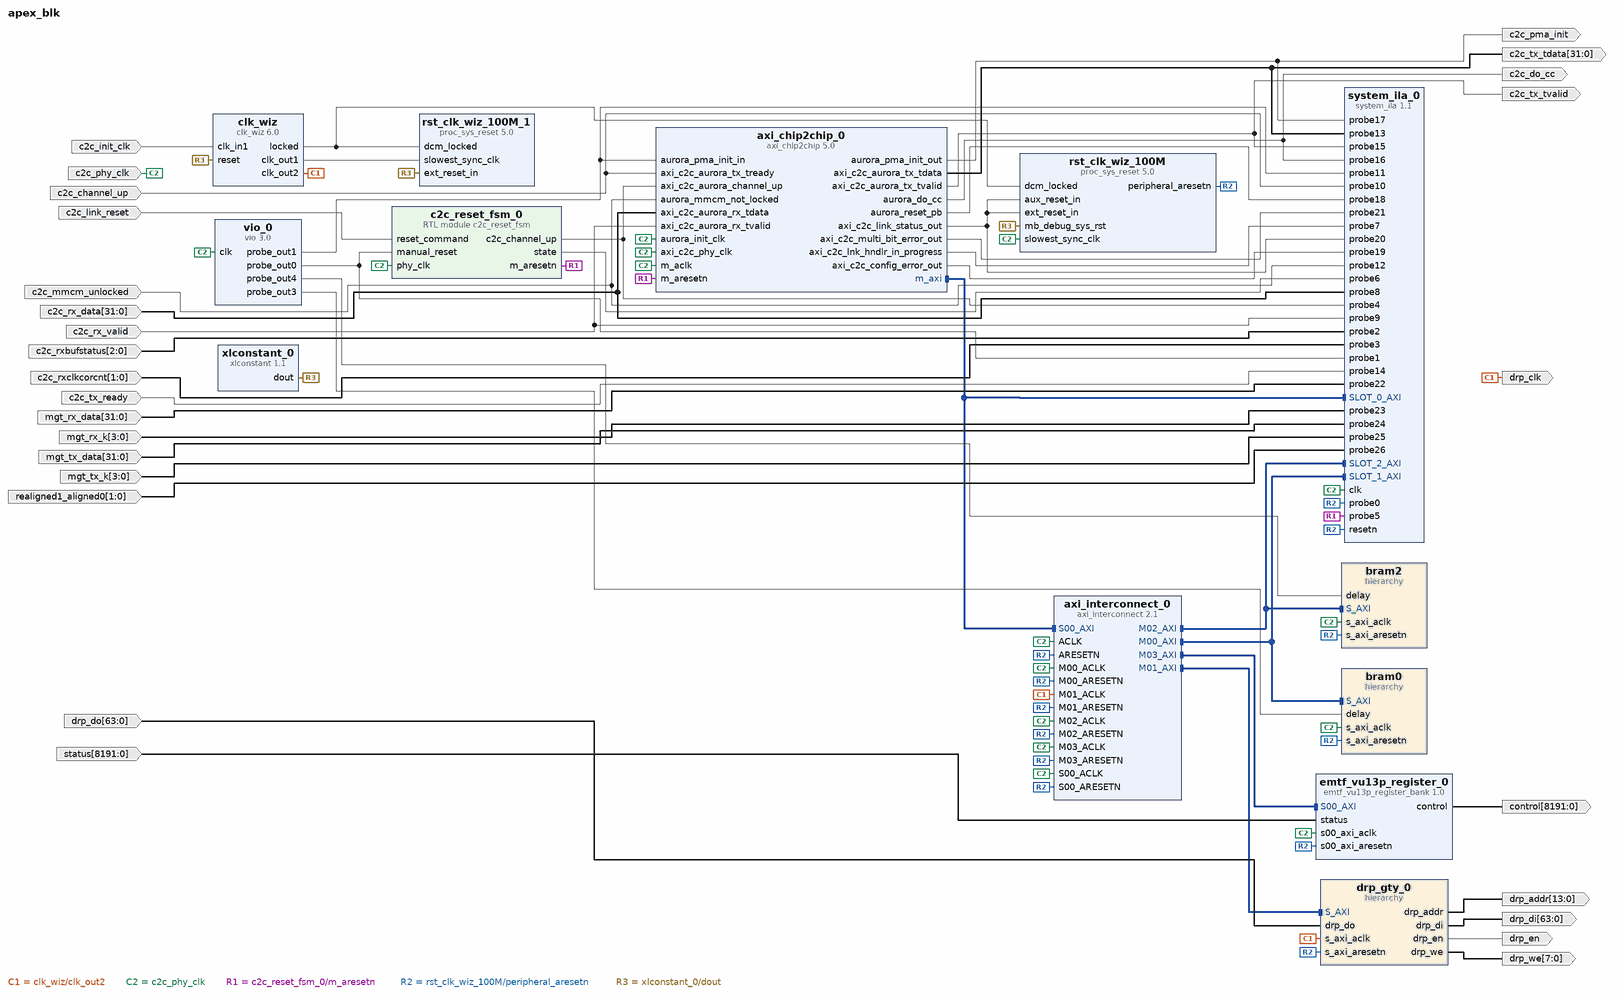
[diagram p0: block diagram of the top level]
# Vivado block design apex_blk, xcvu13p-fsga2577-1-e, Vivado 2022.2
create_bd_design apex_blk

create_bd_port -dir I c2c_channel_up
create_bd_port -dir O c2c_do_cc
create_bd_port -dir I -type clk c2c_init_clk
set_property -dict {CONFIG.FREQ_HZ 156250000} [get_bd_ports c2c_init_clk]
create_bd_port -dir I c2c_link_reset
create_bd_port -dir I -type rst c2c_mmcm_unlocked
set_property -dict {CONFIG.POLARITY ACTIVE_HIGH} [get_bd_ports c2c_mmcm_unlocked]
create_bd_port -dir I -type clk c2c_phy_clk
set_property -dict {CONFIG.FREQ_HZ 195312500 CONFIG.PHASE 0} [get_bd_ports c2c_phy_clk]
create_bd_port -dir O -type rst c2c_pma_init
create_bd_port -dir I -from 31 -to 0 c2c_rx_data
create_bd_port -dir I c2c_rx_valid
create_bd_port -dir I -from 2 -to 0 c2c_rxbufstatus
create_bd_port -dir I -from 1 -to 0 c2c_rxclkcorcnt
create_bd_port -dir I c2c_tx_ready
create_bd_port -dir O -from 31 -to 0 c2c_tx_tdata
create_bd_port -dir O c2c_tx_tvalid
create_bd_port -dir O -from 13 -to 0 drp_addr
create_bd_port -dir O -type clk drp_clk
create_bd_port -dir O -from 63 -to 0 drp_di
create_bd_port -dir I -from 63 -to 0 drp_do
create_bd_port -dir O drp_en
create_bd_port -dir O -from 7 -to 0 drp_we
create_bd_port -dir I -from 31 -to 0 -type data mgt_rx_data
create_bd_port -dir I -from 3 -to 0 -type data mgt_rx_k
create_bd_port -dir I -from 31 -to 0 -type data mgt_tx_data
create_bd_port -dir I -from 3 -to 0 -type data mgt_tx_k
create_bd_port -dir I -from 1 -to 0 -type data realigned1_aligned0
create_bd_port -dir I -from 8191 -to 0 status
create_bd_port -dir O -from 8191 -to 0 control

create_bd_cell -type hier bram0
create_bd_cell -type hier bram2
create_bd_cell -type module -reference c2c_reset_fsm c2c_reset_fsm_0
create_bd_cell -type hier drp_gty_0
create_bd_cell -type ip -vlnv xilinx.com:ip:proc_sys_reset:5.0 rst_clk_wiz_100M
create_bd_cell -type ip -vlnv xilinx.com:ip:proc_sys_reset:5.0 rst_clk_wiz_100M_1
create_bd_cell -type ip -vlnv xilinx.com:ip:axi_interconnect:2.1 axi_interconnect_0
set_property -dict {CONFIG.NUM_MI 4} [get_bd_cells axi_interconnect_0]
create_bd_cell -type ip -vlnv xilinx.com:ip:clk_wiz:6.0 clk_wiz
set_property -dict [list \
  CONFIG.CLKIN1_JITTER_PS 64.0 \
  CONFIG.CLKOUT1_JITTER 107.681 \
  CONFIG.CLKOUT1_PHASE_ERROR 83.183 \
  CONFIG.CLKOUT2_JITTER 123.168 \
  CONFIG.CLKOUT2_PHASE_ERROR 83.183 \
  CONFIG.CLKOUT2_REQUESTED_OUT_FREQ 50 \
  CONFIG.CLKOUT2_USED true \
  CONFIG.MMCM_CLKFBOUT_MULT_F 8.000 \
  CONFIG.MMCM_CLKIN1_PERIOD 6.400 \
  CONFIG.MMCM_CLKIN2_PERIOD 10.0 \
  CONFIG.MMCM_CLKOUT0_DIVIDE_F 12.500 \
  CONFIG.MMCM_CLKOUT1_DIVIDE 25 \
  CONFIG.MMCM_DIVCLK_DIVIDE 1 \
  CONFIG.NUM_OUT_CLKS 2 \
] [get_bd_cells clk_wiz]
create_bd_cell -type ip -vlnv xilinx.com:ip:system_ila:1.1 system_ila_0
set_property -dict [list \
  CONFIG.C_INPUT_PIPE_STAGES 6 \
  CONFIG.C_MON_TYPE MIX \
  CONFIG.C_NUM_MONITOR_SLOTS 3 \
  CONFIG.C_NUM_OF_PROBES 27 \
] [get_bd_cells system_ila_0]
create_bd_cell -type ip -vlnv xilinx.com:ip:vio:3.0 vio_0
set_property -dict [list \
  CONFIG.C_NUM_PROBE_IN 0 \
  CONFIG.C_NUM_PROBE_OUT 5 \
  CONFIG.C_PROBE_OUT0_WIDTH 1 \
  CONFIG.C_PROBE_OUT2_INIT_VAL 0x1 \
  CONFIG.C_PROBE_OUT3_INIT_VAL 0x11 \
  CONFIG.C_PROBE_OUT3_WIDTH 7 \
  CONFIG.C_PROBE_OUT4_INIT_VAL 0x61 \
  CONFIG.C_PROBE_OUT4_WIDTH 7 \
] [get_bd_cells vio_0]
create_bd_cell -type ip -vlnv xilinx.com:ip:xlconstant:1.1 xlconstant_0
set_property -dict {CONFIG.CONST_VAL 0} [get_bd_cells xlconstant_0]
create_bd_cell -type ip -vlnv user.org:user:emtf_vu13p_register_bank:1.0 emtf_vu13p_register_0
create_bd_cell -type ip -vlnv xilinx.com:ip:axi_chip2chip:5.0 axi_chip2chip_0
set_property -dict [list \
  CONFIG.C_ECC_ENABLE false \
  CONFIG.C_EN_AXI_LINK_HNDLR true \
  CONFIG.C_INTERFACE_MODE 1 \
  CONFIG.C_INTERFACE_TYPE 3 \
  CONFIG.C_MASTER_FPGA 0 \
  CONFIG.C_M_AXI_WUSER_WIDTH 0 \
] [get_bd_cells axi_chip2chip_0]

# ---- hierarchy /bram0 ----
current_bd_instance /bram0
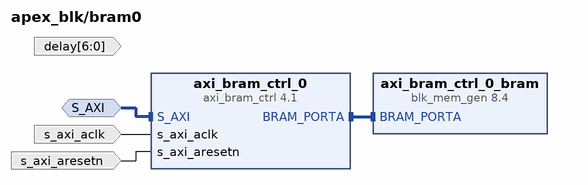
[diagram p1: block diagram inside /bram0]
create_bd_intf_pin -mode Slave -vlnv xilinx.com:interface:aximm_rtl:1.0 S_AXI
create_bd_pin -dir I -from 6 -to 0 delay
create_bd_pin -dir I -type clk s_axi_aclk
create_bd_pin -dir I -type rst s_axi_aresetn

create_bd_cell -type ip -vlnv xilinx.com:ip:blk_mem_gen:8.4 axi_bram_ctrl_0_bram
set_property -dict [list \
  CONFIG.Memory_Type Single_Port_RAM \
  CONFIG.Port_B_Clock 0 \
  CONFIG.Port_B_Enable_Rate 0 \
  CONFIG.Port_B_Write_Rate 0 \
] [get_bd_cells axi_bram_ctrl_0_bram]
create_bd_cell -type ip -vlnv xilinx.com:ip:axi_bram_ctrl:4.1 axi_bram_ctrl_0
set_property -dict {CONFIG.SINGLE_PORT_BRAM 1} [get_bd_cells axi_bram_ctrl_0]

# ---- hierarchy /bram2 ----
current_bd_instance /bram2
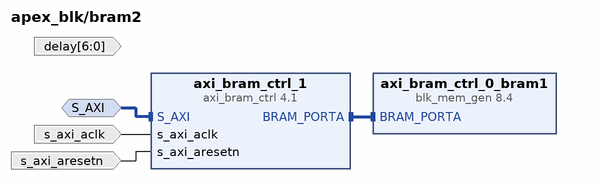
[diagram p2: block diagram inside /bram2]
create_bd_intf_pin -mode Slave -vlnv xilinx.com:interface:aximm_rtl:1.0 S_AXI
create_bd_pin -dir I -from 6 -to 0 delay
create_bd_pin -dir I -type clk s_axi_aclk
create_bd_pin -dir I -type rst s_axi_aresetn

create_bd_cell -type ip -vlnv xilinx.com:ip:blk_mem_gen:8.4 axi_bram_ctrl_0_bram1
create_bd_cell -type ip -vlnv xilinx.com:ip:axi_bram_ctrl:4.1 axi_bram_ctrl_1
set_property -dict {CONFIG.READ_LATENCY 1 CONFIG.SINGLE_PORT_BRAM 1} [get_bd_cells axi_bram_ctrl_1]

# ---- hierarchy /drp_gty_0 ----
current_bd_instance /drp_gty_0
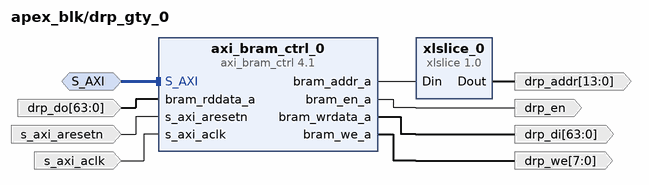
[diagram p3: block diagram inside /drp_gty_0]
create_bd_intf_pin -mode Slave -vlnv xilinx.com:interface:aximm_rtl:1.0 S_AXI
create_bd_pin -dir O -from 13 -to 0 drp_addr
create_bd_pin -dir O -from 63 -to 0 drp_di
create_bd_pin -dir I -from 63 -to 0 drp_do
create_bd_pin -dir O drp_en
create_bd_pin -dir O -from 7 -to 0 drp_we
create_bd_pin -dir I -type clk s_axi_aclk
create_bd_pin -dir I -type rst s_axi_aresetn

create_bd_cell -type ip -vlnv xilinx.com:ip:xlslice:1.0 xlslice_0
set_property -dict {CONFIG.DIN_FROM 16 CONFIG.DIN_TO 3 CONFIG.DIN_WIDTH 17 CONFIG.DOUT_WIDTH 14} [get_bd_cells xlslice_0]
create_bd_cell -type ip -vlnv xilinx.com:ip:axi_bram_ctrl:4.1 axi_bram_ctrl_0
set_property -dict {CONFIG.DATA_WIDTH 64 CONFIG.SINGLE_PORT_BRAM 1} [get_bd_cells axi_bram_ctrl_0]

# ---- connections ----

current_bd_instance /bram0
connect_bd_intf_net [get_bd_intf_pins S_AXI] [get_bd_intf_pins axi_bram_ctrl_0/S_AXI]
connect_bd_intf_net [get_bd_intf_pins axi_bram_ctrl_0/BRAM_PORTA] [get_bd_intf_pins axi_bram_ctrl_0_bram/BRAM_PORTA]
connect_bd_net [get_bd_pins s_axi_aclk] [get_bd_pins axi_bram_ctrl_0/s_axi_aclk]
connect_bd_net [get_bd_pins s_axi_aresetn] [get_bd_pins axi_bram_ctrl_0/s_axi_aresetn]

current_bd_instance /bram2
connect_bd_intf_net [get_bd_intf_pins axi_bram_ctrl_0_bram1/BRAM_PORTA] [get_bd_intf_pins axi_bram_ctrl_1/BRAM_PORTA]
connect_bd_intf_net [get_bd_intf_pins S_AXI] [get_bd_intf_pins axi_bram_ctrl_1/S_AXI]
connect_bd_net -net clk_wiz_clk_out1 [get_bd_pins s_axi_aclk] [get_bd_pins axi_bram_ctrl_1/s_axi_aclk]
connect_bd_net -net rst_clk_wiz_100M_peripheral_aresetn [get_bd_pins s_axi_aresetn] [get_bd_pins axi_bram_ctrl_1/s_axi_aresetn]

current_bd_instance /drp_gty_0
connect_bd_intf_net [get_bd_intf_pins S_AXI] [get_bd_intf_pins axi_bram_ctrl_0/S_AXI]
connect_bd_net [get_bd_pins axi_bram_ctrl_0/bram_addr_a] [get_bd_pins xlslice_0/Din]
connect_bd_net [get_bd_pins axi_bram_ctrl_0/bram_en_a] [get_bd_pins drp_en]
connect_bd_net [get_bd_pins axi_bram_ctrl_0/bram_we_a] [get_bd_pins drp_we]
connect_bd_net [get_bd_pins axi_bram_ctrl_0/bram_wrdata_a] [get_bd_pins drp_di]
connect_bd_net [get_bd_pins drp_do] [get_bd_pins axi_bram_ctrl_0/bram_rddata_a]
connect_bd_net -net rst_clk_wiz_100M_peripheral_aresetn [get_bd_pins s_axi_aresetn] [get_bd_pins axi_bram_ctrl_0/s_axi_aresetn]
connect_bd_net [get_bd_pins s_axi_aclk] [get_bd_pins axi_bram_ctrl_0/s_axi_aclk]
connect_bd_net [get_bd_pins xlslice_0/Dout] [get_bd_pins drp_addr]

current_bd_instance /
connect_bd_intf_net [get_bd_intf_pins axi_chip2chip_0/m_axi] [get_bd_intf_pins axi_interconnect_0/S00_AXI]
connect_bd_intf_net [get_bd_intf_pins axi_chip2chip_0/m_axi] [get_bd_intf_pins system_ila_0/SLOT_0_AXI]
connect_bd_intf_net [get_bd_intf_pins axi_interconnect_0/M00_AXI] [get_bd_intf_pins bram0/S_AXI]
connect_bd_intf_net [get_bd_intf_pins axi_interconnect_0/M00_AXI] [get_bd_intf_pins system_ila_0/SLOT_1_AXI]
connect_bd_intf_net [get_bd_intf_pins axi_interconnect_0/M01_AXI] [get_bd_intf_pins drp_gty_0/S_AXI]
connect_bd_intf_net [get_bd_intf_pins axi_interconnect_0/M02_AXI] [get_bd_intf_pins bram2/S_AXI]
connect_bd_intf_net [get_bd_intf_pins axi_interconnect_0/M02_AXI] [get_bd_intf_pins system_ila_0/SLOT_2_AXI]
connect_bd_intf_net [get_bd_intf_pins axi_interconnect_0/M03_AXI] [get_bd_intf_pins emtf_vu13p_register_0/S00_AXI]
connect_bd_net [get_bd_pins clk_wiz/clk_out2] [get_bd_ports drp_clk] [get_bd_pins drp_gty_0/s_axi_aclk] [get_bd_pins axi_interconnect_0/M01_ACLK]
connect_bd_net -net aurora_pma_init [get_bd_pins vio_0/probe_out1] [get_bd_pins system_ila_0/probe11] [get_bd_pins axi_chip2chip_0/aurora_pma_init_in]
connect_bd_net -net aurora_pma_init_out [get_bd_pins axi_chip2chip_0/aurora_pma_init_out] \
  [get_bd_ports c2c_pma_init] [get_bd_pins system_ila_0/probe17]
connect_bd_net -net aurora_reset_pb [get_bd_pins axi_chip2chip_0/aurora_reset_pb] [get_bd_pins system_ila_0/probe18]
connect_bd_net -net axi_bram_ctrl_0_bram_en_a [get_bd_pins drp_gty_0/drp_en] [get_bd_ports drp_en]
connect_bd_net -net axi_bram_ctrl_0_bram_we_a [get_bd_pins drp_gty_0/drp_we] [get_bd_ports drp_we]
connect_bd_net -net axi_bram_ctrl_0_bram_wrdata_a [get_bd_pins drp_gty_0/drp_di] [get_bd_ports drp_di]
connect_bd_net -net axi_c2c_multi_bit_error_out [get_bd_pins axi_chip2chip_0/axi_c2c_multi_bit_error_out] [get_bd_pins system_ila_0/probe21]
connect_bd_net -net axi_c2c_phy_clk_0_1 [get_bd_ports c2c_phy_clk] \
  [get_bd_pins bram0/s_axi_aclk] [get_bd_pins bram2/s_axi_aclk] [get_bd_pins c2c_reset_fsm_0/phy_clk] \
  [get_bd_pins rst_clk_wiz_100M/slowest_sync_clk] [get_bd_pins axi_interconnect_0/ACLK] \
  [get_bd_pins axi_interconnect_0/S00_ACLK] [get_bd_pins axi_interconnect_0/M00_ACLK] \
  [get_bd_pins axi_interconnect_0/M02_ACLK] [get_bd_pins axi_interconnect_0/M03_ACLK] [get_bd_pins system_ila_0/clk] \
  [get_bd_pins vio_0/clk] [get_bd_pins emtf_vu13p_register_0/s00_axi_aclk] [get_bd_pins axi_chip2chip_0/m_aclk] \
  [get_bd_pins axi_chip2chip_0/axi_c2c_phy_clk] [get_bd_pins axi_chip2chip_0/aurora_init_clk]
connect_bd_net [get_bd_pins axi_chip2chip_0/axi_c2c_lnk_hndlr_in_progress] [get_bd_pins system_ila_0/probe7]
connect_bd_net -net bram1_delay [get_bd_pins vio_0/probe_out3] [get_bd_pins bram0/delay]
connect_bd_net -net bram2_delay [get_bd_pins vio_0/probe_out4] [get_bd_pins bram2/delay]
connect_bd_net [get_bd_ports c2c_channel_up] [get_bd_pins system_ila_0/probe10] [get_bd_pins axi_chip2chip_0/axi_c2c_aurora_tx_tready]
connect_bd_net -net c2c_config_error_out [get_bd_pins axi_chip2chip_0/axi_c2c_config_error_out] [get_bd_pins system_ila_0/probe19]
connect_bd_net [get_bd_ports c2c_link_reset] [get_bd_pins c2c_reset_fsm_0/reset_command]
connect_bd_net -net c2c_link_status_out [get_bd_pins axi_chip2chip_0/axi_c2c_link_status_out] \
  [get_bd_pins rst_clk_wiz_100M/aux_reset_in] [get_bd_pins rst_clk_wiz_100M/ext_reset_in] [get_bd_pins system_ila_0/probe20]
connect_bd_net -net c2c_m_aresetn [get_bd_pins c2c_reset_fsm_0/m_aresetn] [get_bd_pins system_ila_0/probe5] [get_bd_pins axi_chip2chip_0/m_aresetn]
connect_bd_net [get_bd_ports c2c_mmcm_unlocked] [get_bd_pins system_ila_0/probe12] [get_bd_pins axi_chip2chip_0/aurora_mmcm_not_locked]
connect_bd_net -net c2c_reset_fsm_state [get_bd_pins c2c_reset_fsm_0/state] [get_bd_pins system_ila_0/probe6]
connect_bd_net [get_bd_ports c2c_rx_data] [get_bd_pins system_ila_0/probe8] [get_bd_pins axi_chip2chip_0/axi_c2c_aurora_rx_tdata]
connect_bd_net [get_bd_ports c2c_rx_valid] [get_bd_pins system_ila_0/probe9] [get_bd_pins axi_chip2chip_0/axi_c2c_aurora_rx_tvalid]
connect_bd_net [get_bd_ports c2c_rxbufstatus] [get_bd_pins system_ila_0/probe2]
connect_bd_net [get_bd_ports c2c_rxclkcorcnt] [get_bd_pins system_ila_0/probe3]
connect_bd_net -net c2c_tx_data [get_bd_pins axi_chip2chip_0/axi_c2c_aurora_tx_tdata] [get_bd_ports c2c_tx_tdata] [get_bd_pins system_ila_0/probe13]
connect_bd_net [get_bd_ports c2c_tx_ready] [get_bd_pins system_ila_0/probe14]
connect_bd_net -net c2c_tx_valid [get_bd_pins axi_chip2chip_0/axi_c2c_aurora_tx_tvalid] \
  [get_bd_ports c2c_tx_tvalid] [get_bd_pins system_ila_0/probe15]
connect_bd_net -net clk_in1_0_1 [get_bd_ports c2c_init_clk] [get_bd_pins clk_wiz/clk_in1]
connect_bd_net [get_bd_pins clk_wiz/clk_out1] [get_bd_pins rst_clk_wiz_100M_1/slowest_sync_clk]
connect_bd_net [get_bd_pins clk_wiz/locked] [get_bd_pins rst_clk_wiz_100M/dcm_locked] [get_bd_pins rst_clk_wiz_100M_1/dcm_locked]
connect_bd_net -net do_cc [get_bd_pins axi_chip2chip_0/aurora_do_cc] [get_bd_ports c2c_do_cc] [get_bd_pins system_ila_0/probe16]
connect_bd_net [get_bd_ports drp_do] [get_bd_pins drp_gty_0/drp_do]
connect_bd_net [get_bd_pins emtf_vu13p_register_0/control] [get_bd_ports control]
connect_bd_net -net fsm_c2c_channel_up [get_bd_pins c2c_reset_fsm_0/c2c_channel_up] \
  [get_bd_pins system_ila_0/probe4] [get_bd_pins axi_chip2chip_0/axi_c2c_aurora_channel_up]
connect_bd_net [get_bd_ports mgt_rx_data] [get_bd_pins system_ila_0/probe22]
connect_bd_net [get_bd_ports mgt_rx_k] [get_bd_pins system_ila_0/probe23]
connect_bd_net [get_bd_ports mgt_tx_data] [get_bd_pins system_ila_0/probe24]
connect_bd_net [get_bd_ports mgt_tx_k] [get_bd_pins system_ila_0/probe25]
connect_bd_net -net realigned1_aligned0_1 [get_bd_ports realigned1_aligned0] [get_bd_pins system_ila_0/probe26]
connect_bd_net [get_bd_pins rst_clk_wiz_100M/peripheral_aresetn] \
  [get_bd_pins bram0/s_axi_aresetn] [get_bd_pins bram2/s_axi_aresetn] [get_bd_pins drp_gty_0/s_axi_aresetn] \
  [get_bd_pins axi_interconnect_0/ARESETN] [get_bd_pins axi_interconnect_0/S00_ARESETN] \
  [get_bd_pins axi_interconnect_0/M00_ARESETN] [get_bd_pins axi_interconnect_0/M01_ARESETN] \
  [get_bd_pins axi_interconnect_0/M02_ARESETN] [get_bd_pins axi_interconnect_0/M03_ARESETN] [get_bd_pins system_ila_0/probe0] \
  [get_bd_pins system_ila_0/resetn] [get_bd_pins emtf_vu13p_register_0/s00_axi_aresetn]
connect_bd_net -net status_0_1 [get_bd_ports status] [get_bd_pins emtf_vu13p_register_0/status]
connect_bd_net -net vio_channel_up [get_bd_pins vio_0/probe_out0] [get_bd_pins c2c_reset_fsm_0/manual_reset] [get_bd_pins system_ila_0/probe1]
connect_bd_net [get_bd_pins xlconstant_0/dout] \
  [get_bd_pins rst_clk_wiz_100M/mb_debug_sys_rst] [get_bd_pins rst_clk_wiz_100M_1/ext_reset_in] [get_bd_pins clk_wiz/reset]
connect_bd_net -net xlslice_0_Dout [get_bd_pins drp_gty_0/drp_addr] [get_bd_ports drp_addr]
set_property HDL_ATTRIBUTE.DEBUG true [get_bd_nets aurora_pma_init]
set_property HDL_ATTRIBUTE.MARK_DEBUG true [get_bd_nets aurora_pma_init]
set_property HDL_ATTRIBUTE.DEBUG true [get_bd_nets axi_c2c_multi_bit_error_out]
set_property HDL_ATTRIBUTE.MARK_DEBUG true [get_bd_nets axi_c2c_multi_bit_error_out]
set_property HDL_ATTRIBUTE.DEBUG true [get_bd_nets c2c_config_error_out]
set_property HDL_ATTRIBUTE.MARK_DEBUG true [get_bd_nets c2c_config_error_out]
set_property HDL_ATTRIBUTE.DEBUG true [get_bd_nets c2c_link_status_out]
set_property HDL_ATTRIBUTE.MARK_DEBUG true [get_bd_nets c2c_link_status_out]

# ---- address map ----
assign_bd_address -offset 0x00000000 -range 64K -target_address_space [get_bd_addr_spaces axi_chip2chip_0/MAXI] [get_bd_addr_segs bram0/axi_bram_ctrl_0/S_AXI/Mem0]
assign_bd_address -offset 0x02000000 -range 64K -target_address_space [get_bd_addr_spaces axi_chip2chip_0/MAXI] [get_bd_addr_segs bram2/axi_bram_ctrl_1/S_AXI/Mem0]
assign_bd_address -offset 0x02100000 -range 64K -target_address_space [get_bd_addr_spaces axi_chip2chip_0/MAXI] [get_bd_addr_segs emtf_vu13p_register_0/S00_AXI/S00_AXI_reg]
assign_bd_address -offset 0x04000000 -range 128K -target_address_space [get_bd_addr_spaces axi_chip2chip_0/MAXI] [get_bd_addr_segs drp_gty_0/axi_bram_ctrl_0/S_AXI/Mem0]

validate_bd_design
save_bd_design
